# EAGLE schematic rc28c16rom (EAGLE 9.6.2)
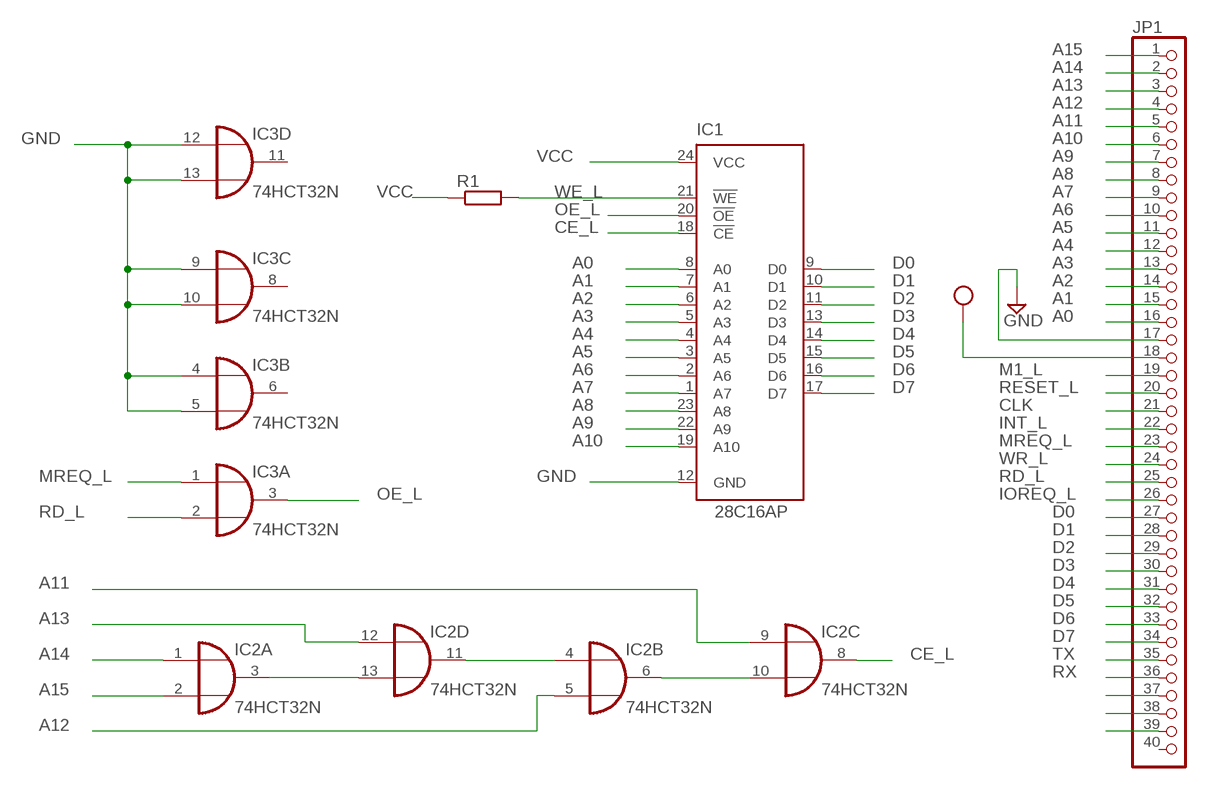
[diagram p0: schematic, sheet 1]

## Parts
IC1  28C16AP  [DIL24-6]
IC2  74HCT32N  [DIL14]
IC3  74HCT32N  [DIL14]
JP1  PINHD-1X40  [1X40]
R1  R-EU_0204/5  [0204/5]

## Nets
A0: IC1.8(A0) JP1.16
A1: IC1.7(A1) JP1.15
A2: IC1.6(A2) JP1.14
A3: IC1.5(A3) JP1.13
A4: IC1.4(A4) JP1.12
A5: IC1.3(A5) JP1.11
A6: IC1.2(A6) JP1.10
A7: IC1.1(A7) JP1.9
A8: IC1.23(A8) JP1.8
A9: IC1.22(A9) JP1.7
A10: IC1.19(A10) JP1.6
A11: IC2.9(C:I0) JP1.5
A12: IC2.5(B:I1) JP1.4
A13: IC2.12(D:I0) JP1.3
A14: IC2.1(A:I0) JP1.2
A15: IC2.2(A:I1) JP1.1
CE_L: IC1.18(!CE) IC2.8(C:O)
CLK: JP1.21
D0: IC1.9(D0) JP1.27
D1: IC1.10(D1) JP1.28
D2: IC1.11(D2) JP1.29
D3: IC1.13(D3) JP1.30
D4: IC1.14(D4) JP1.31
D5: IC1.15(D5) JP1.32
D6: IC1.16(D6) JP1.33
D7: IC1.17(D7) JP1.34
GND: IC1.12(GND) IC3.4(B:I0) IC3.5(B:I1) IC3.9(C:I0) IC3.10(C:I1) IC3.12(D:I0) IC3.13(D:I1) JP1.17
INT_L: JP1.22
IOREQ_L: JP1.26
M1_L: JP1.19
MREQ_L: IC3.1(A:I0) JP1.23
N$1: JP1.37
N$2: JP1.38
N$3: JP1.39
N$4: IC2.6(B:O) IC2.10(C:I1)
N$5: IC2.3(A:O) IC2.13(D:I1)
N$6: IC2.4(B:I0) IC2.11(D:O)
OE_L: IC1.20(!OE) IC3.3(A:O)
RD_L: IC3.2(A:I1) JP1.25
RESET_L: JP1.20
RX: JP1.36
TX: JP1.35
VCC: IC1.24(VCC) JP1.18 R1.1
WE_L: IC1.21(!WE) R1.2
WR_L: JP1.24
Unconnected: IC3.6(B:O) IC3.8(C:O) IC3.11(D:O) JP1.40

## Power pins joined to a net without a drawn wire
GND: IC2.7(P:GND) IC3.7(P:GND)
VCC: IC2.14(P:VCC) IC3.14(P:VCC)

## Library data of the parts
IC1 = microchip:28*16A: CMOS EPROM 16 K (2 K x 8) Source: ww1.microchip.com/downloads/en/DeviceDoc/11125J.pdf; MPN: CAT28C16ALI-12; OC_FARNELL: 1718292; OC_NEWARK: 06R0648
IC2 IC3 = 74xx-eu:74*32: Quad 2-input OR gate
JP1 = pinhead:PINHD-1X40: PIN HEADER
R1 = rcl:R-EU_: RESISTOR, European symbol; SPICEPREFIX: R